# Altium schematic sheet Motor Control.SchDoc
size A4
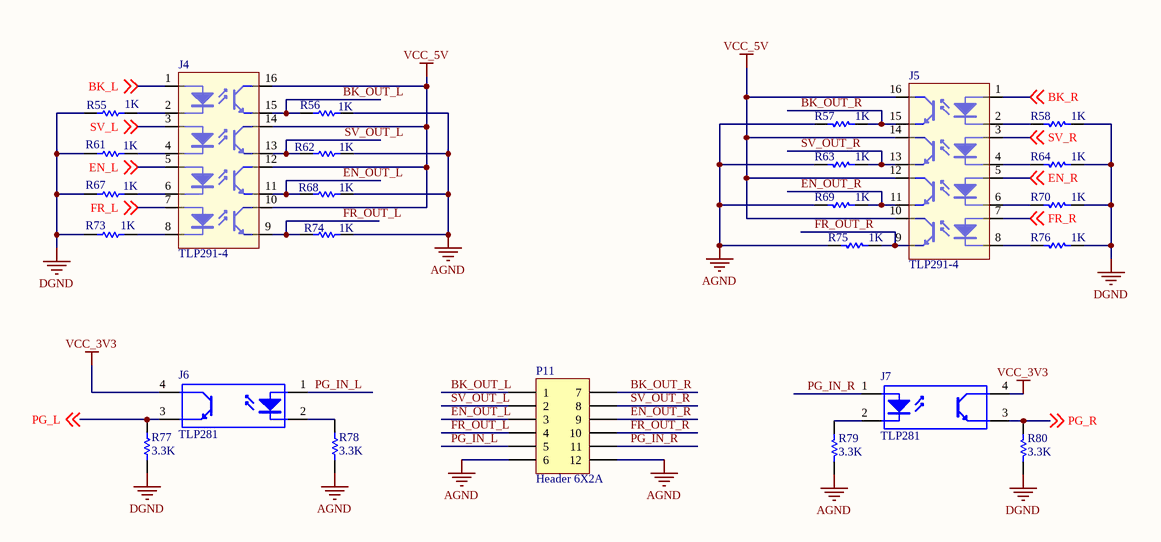
[diagram p0: Motor Control.SchDoc]

## Parts
J4  TLP291-4  [SOIC127P700X210-16N]
J5  TLP291-4  [SOIC127P700X210-16N]
J6  TLP281  [SOP127P710X350-4N]
J7  TLP281  [SOP127P710X350-4N]
P11  Header 6X2A  [Molex-12P]
R55  value 1K  [R0805]  (hidden comment: Res1)
R56  value 1K  [R0805]  (hidden comment: Res1)
R57  value 1K  [R0805]  (hidden comment: Res1)
R58  value 1K  [R0805]  (hidden comment: Res1)
R61  value 1K  [R0805]  (hidden comment: Res1)
R62  value 1K  [R0805]  (hidden comment: Res1)
R63  value 1K  [R0805]  (hidden comment: Res1)
R64  value 1K  [R0805]  (hidden comment: Res1)
R67  value 1K  [R0805]  (hidden comment: Res1)
R68  value 1K  [R0805]  (hidden comment: Res1)
R69  value 1K  [R0805]  (hidden comment: Res1)
R70  value 1K  [R0805]  (hidden comment: Res1)
R73  value 1K  [R0805]  (hidden comment: Res1)
R74  value 1K  [R0805]  (hidden comment: Res1)
R75  value 1K  [R0805]  (hidden comment: Res1)
R76  value 1K  [R0805]  (hidden comment: Res1)
R77  value 3.3K  [R0805]  (hidden comment: Res1)
R78  value 3.3K  [R0805]  (hidden comment: Res1)
R79  value 3.3K  [R0805]  (hidden comment: Res1)
R80  value 3.3K  [R0805]  (hidden comment: Res1)

## Nets
AGND: P11.6 P11.12 R56.2 R57.2 R62.2 R63.2 R68.2 R69.2 R74.2 R75.2 R78.2 R79.2
DGND: R55.2 R58.2 R61.2 R64.2 R67.2 R70.2 R73.2 R76.2 R77.1 R80.2
VCC_3V3: J6.4(C) J7.4(C)
VCC_5V: J4.10(C) J4.12(C) J4.14(C) J4.16(C) J5.10(C) J5.12(C) J5.14(C) J5.16(C)
BK_L: J4.1(A) ; off-sheet BK_L
BK_OUT_L: J4.15(E) P11.1 R56.1
BK_OUT_R: J5.15(E) P11.7 R57.1
BK_R: J5.1(A) ; off-sheet BK_R
EN_L: J4.5(A) ; off-sheet EN_L
EN_OUT_L: J4.11(E) P11.3 R68.1
EN_OUT_R: J5.11(E) P11.9 R69.1
EN_R: J5.5(A) ; off-sheet EN_R
FR_L: J4.7(A) ; off-sheet FR_L
FR_OUT_L: J4.9(E) P11.4 R74.1
FR_OUT_R: J5.9(E) P11.10 R75.1
FR_R: J5.7(A) ; off-sheet FR_R
PG_IN_L: J6.1(A) P11.5
PG_IN_R: J7.1(A) P11.11
PG_L: J6.3(E) R77.2 ; off-sheet PG_L
PG_R: J7.3(E) R80.1 ; off-sheet PG_R
SV_L: J4.3(A) ; off-sheet SV_L
SV_OUT_L: J4.13(E) P11.2 R62.1
SV_OUT_R: J5.13(E) P11.8 R63.1
SV_R: J5.3(A) ; off-sheet SV_R
NetJ4_2: J4.2(K) R55.1
NetJ4_4: J4.4(K) R61.1
NetJ4_6: J4.6(K) R67.1
NetJ4_8: J4.8(K) R73.1
NetJ5_2: J5.2(K) R58.1
NetJ5_4: J5.4(K) R64.1
NetJ5_6: J5.6(K) R70.1
NetJ5_8: J5.8(K) R76.1
NetJ6_2: J6.2(K) R78.1
NetJ7_2: J7.2(K) R79.1

## Notes on the sheet
- Labels drawn without touching a wire or pin: /, =Date, =DocumentName, =DocumentNumber, =Engineer, =ProjectName, =Revision, =SheetNumber, =Time, Checkedby：, Date：, DocumentName：, DocumentNumber/SheetNumber：, Engineer：, ProjectName：, Revision：, Time：

## Library data of the parts
J4 J5 = TLP291-4: 光耦
J6 J7 = TLP281: 光耦; Published: 24-Mar-1999; LatestRevisionDate: 04-Mar-2005; LatestRevisionNote: Sch pins 3 & 4 Swapped.; DatasheetDocument: Nov-2003; PackageReference: DIP-4; Publisher: Altium Limited
P11 = Header 6X2A: Header, 6-Pin, Dual row; LatestRevisionDate: 17-Jul-2002; LatestRevisionNote: Re-released for DXP Platform.; Publisher: Altium Limited
R55-R58 R61-R64 R67-R70 R73-R80 = Res1: Resistor; Published: 8-Jun-2000; LatestRevisionDate: 17-Jul-2002; LatestRevisionNote: Re-released for DXP Platform.; PackageReference: AXIAL-0.3; Publisher: Altium Limited; PackageDescription: Axial Device, Thru-Hole; 2 Leads; 0.3 in Pin Spacing